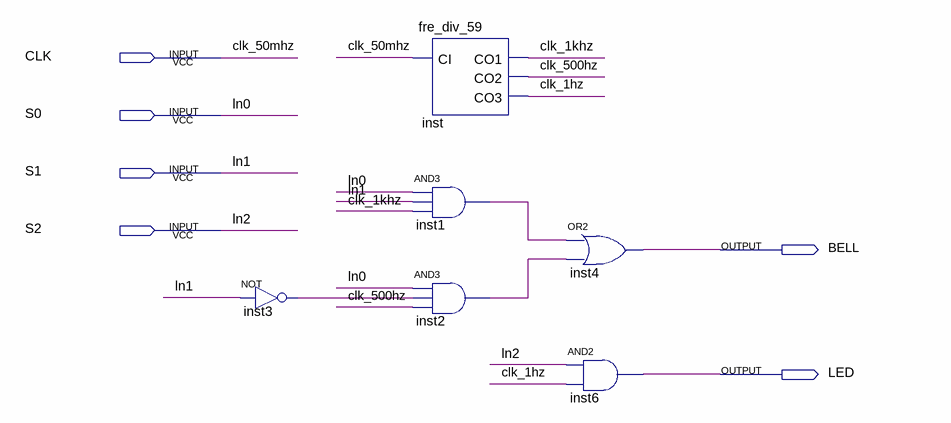
[diagram p0: schematic sheet]
// Quartus schematic example_entity.bdf as structural Verilog: 6 symbols, 6 pins
module example_entity (
  input  CLK,
  input  S0,
  input  S1,
  input  S2,
  output BELL,
  output LED
);

  wire clk_1hz, clk_1khz, clk_500hz, inst1_out, inst2_out, inst3_out;

  not inst3 (inst3_out, S1);
  fre_div_59 inst (.CI(CLK), .CO1(clk_1khz), .CO2(clk_500hz), .CO3(clk_1hz));
  and inst1 (inst1_out, S0, S1, clk_1khz);
  and inst2 (inst2_out, S0, inst3_out, clk_500hz);
  or inst4 (BELL, inst1_out, inst2_out);
  and inst6 (LED, S2, clk_1hz);

  // Other names for the same wires on the sheet: clk_50mhz = CLK; ln0 = S0; ln1 = S1; ln2 = S2
endmodule
